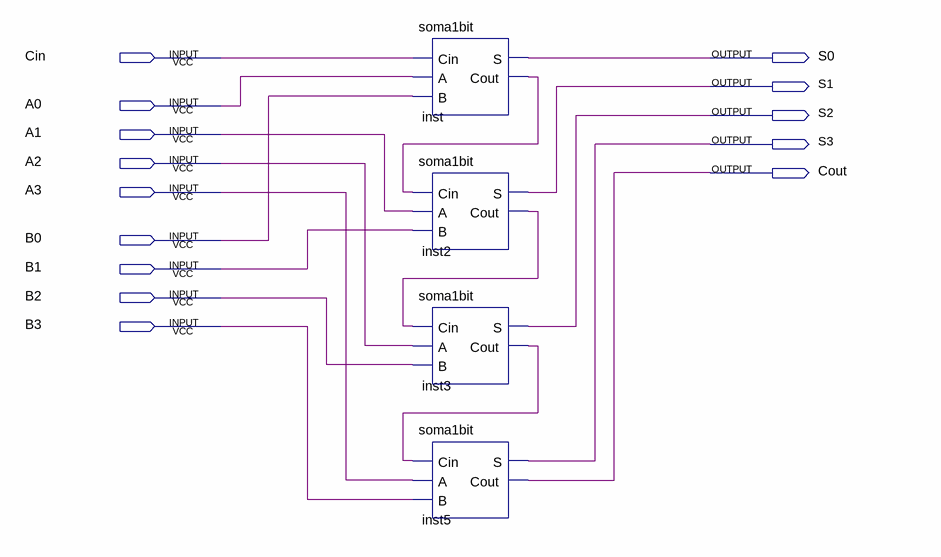
[diagram p0: schematic sheet]
// Quartus schematic soma4bits.bdf as structural Verilog: 4 symbols, 14 pins
module soma4bits (
  input  Cin,
  input  A0,
  input  A1,
  input  A2,
  input  A3,
  input  B0,
  input  B1,
  input  B2,
  input  B3,
  output S0,
  output S1,
  output S2,
  output S3,
  output Cout
);

  wire inst2_cout, inst3_cout, inst_cout;

  soma1bit inst (.Cin(Cin), .A(A0), .B(B0), .S(S0), .Cout(inst_cout));
  soma1bit inst2 (.Cin(inst_cout), .A(A1), .B(B1), .S(S1), .Cout(inst2_cout));
  soma1bit inst3 (.Cin(inst2_cout), .A(A2), .B(B2), .S(S2), .Cout(inst3_cout));
  soma1bit inst5 (.Cin(inst3_cout), .A(A3), .B(B3), .S(S3), .Cout(Cout));
endmodule
